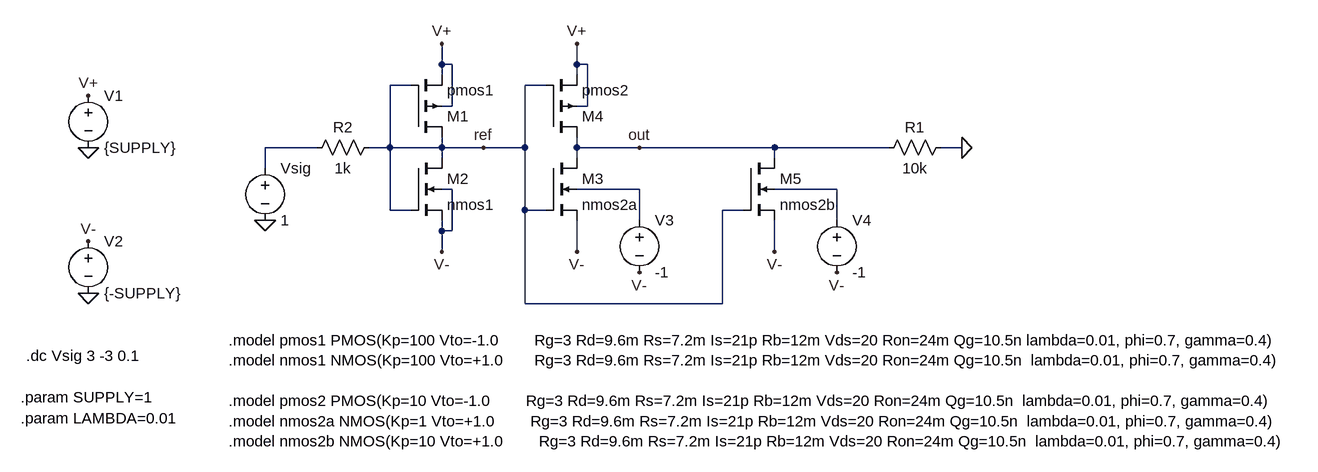
[diagram p0: schematic Week14_CMOS_Body_Effect.asc]
Week14_CMOS_Body_Effect.asc, the LTspice schematic file:
Version 4
SHEET 1 2176 680
WIRE 304 -112 304 -144
WIRE 320 -112 304 -112
WIRE 512 -112 512 -144
WIRE 528 -112 512 -112
WIRE 304 -96 304 -112
WIRE 512 -96 512 -112
WIRE 256 -80 224 -80
WIRE 464 -80 432 -80
WIRE 320 -48 320 -112
WIRE 320 -48 304 -48
WIRE 528 -48 528 -112
WIRE 528 -48 512 -48
WIRE 112 16 32 16
WIRE 224 16 224 -80
WIRE 224 16 192 16
WIRE 304 16 304 0
WIRE 304 16 224 16
WIRE 368 16 304 16
WIRE 432 16 432 -80
WIRE 432 16 368 16
WIRE 512 16 512 0
WIRE 608 16 512 16
WIRE 816 16 608 16
WIRE 992 16 816 16
WIRE 1104 16 1072 16
WIRE 304 32 304 16
WIRE 512 32 512 16
WIRE 816 32 816 16
WIRE 32 48 32 16
WIRE 320 80 304 80
WIRE 608 80 512 80
WIRE 912 80 816 80
WIRE 224 112 224 16
WIRE 256 112 224 112
WIRE 432 112 432 16
WIRE 464 112 432 112
WIRE 768 112 736 112
WIRE 608 128 608 80
WIRE 912 128 912 80
WIRE 304 144 304 128
WIRE 320 144 320 80
WIRE 320 144 304 144
WIRE 304 176 304 144
WIRE 512 176 512 128
WIRE 816 176 816 128
WIRE 432 256 432 112
WIRE 736 256 736 112
WIRE 736 256 432 256
FLAG -240 16 0
FLAG -240 -64 V+
FLAG -240 240 0
FLAG -240 160 V-
FLAG 304 -144 V+
FLAG 32 128 0
FLAG 304 176 V-
FLAG 512 -144 V+
FLAG 512 176 V-
FLAG 608 16 out
FLAG 368 16 ref
FLAG 1104 16 0
FLAG 816 176 V-
FLAG 608 208 V-
FLAG 912 208 V-
SYMBOL voltage -240 -80 R0
WINDOW 123 0 0 Left 0
WINDOW 39 0 0 Left 0
SYMATTR InstName V1
SYMATTR Value {SUPPLY}
SYMBOL voltage -240 144 R0
WINDOW 123 0 0 Left 0
WINDOW 39 0 0 Left 0
SYMATTR InstName V2
SYMATTR Value {-SUPPLY}
SYMBOL voltage 32 32 R0
WINDOW 123 0 0 Left 0
WINDOW 39 0 0 Left 0
SYMATTR InstName Vsig
SYMATTR Value 1
SYMBOL res 96 32 R270
WINDOW 0 32 56 VTop 2
WINDOW 3 0 56 VBottom 2
SYMATTR InstName R2
SYMATTR Value 1k
SYMBOL res 976 32 R270
WINDOW 0 32 56 VTop 2
WINDOW 3 0 56 VBottom 2
SYMATTR InstName R1
SYMATTR Value 10k
SYMBOL pmos4 256 0 M180
SYMATTR InstName M1
SYMATTR Value pmos1
SYMBOL pmos4 464 0 M180
SYMATTR InstName M4
SYMATTR Value pmos2
SYMBOL nmos4 256 32 R0
SYMATTR InstName M2
SYMATTR Value nmos1
SYMBOL nmos4 464 32 R0
SYMATTR InstName M3
SYMATTR Value nmos2a
SYMBOL nmos4 768 32 R0
SYMATTR InstName M5
SYMATTR Value nmos2b
SYMBOL voltage 608 112 R0
WINDOW 123 0 0 Left 0
WINDOW 39 0 0 Left 0
SYMATTR InstName V3
SYMATTR Value -1
SYMBOL voltage 912 112 R0
WINDOW 123 0 0 Left 0
WINDOW 39 0 0 Left 0
SYMATTR InstName V4
SYMATTR Value -1
TEXT -24 312 Left 2 !.model pmos1 PMOS(Kp=100 Vto=-1.0        Rg=3 Rd=9.6m Rs=7.2m Is=21p Rb=12m Vds=20 Ron=24m Qg=10.5n lambda=0.01, phi=0.7, gamma=0.4)\n.model nmos1 NMOS(Kp=100 Vto=+1.0       Rg=3 Rd=9.6m Rs=7.2m Is=21p Rb=12m Vds=20 Ron=24m Qg=10.5n  lambda=0.01, phi=0.7, gamma=0.4)\n \n.model pmos2 PMOS(Kp=10 Vto=-1.0        Rg=3 Rd=9.6m Rs=7.2m Is=21p Rb=12m Vds=20 Ron=24m Qg=10.5n  lambda=0.01, phi=0.7, gamma=0.4)\n.model nmos2a NMOS(Kp=1 Vto=+1.0        Rg=3 Rd=9.6m Rs=7.2m Is=21p Rb=12m Vds=20 Ron=24m Qg=10.5n  lambda=0.01, phi=0.7, gamma=0.4)\n.model nmos2b NMOS(Kp=10 Vto=+1.0        Rg=3 Rd=9.6m Rs=7.2m Is=21p Rb=12m Vds=20 Ron=24m Qg=10.5n  lambda=0.01, phi=0.7, gamma=0.4)
TEXT -344 400 Left 2 !.param SUPPLY=1
TEXT -336 336 Left 2 !.dc Vsig 3 -3 0.1
TEXT -344 432 Left 2 !.param LAMBDA=0.01

The netlist it stands for:
* Week14_CMOS_Body_Effect.asc
V1 V+ 0 {SUPPLY}
V2 V- 0 {-SUPPLY}
Vsig N001 0 1
R2 N001 ref 1k
R1 out 0 10k
M1 ref ref V+ V+ pmos1
M4 out ref V+ V+ pmos2
M2 ref ref V- V- nmos1
M3 out ref V- N002 nmos2a
M5 out ref V- N003 nmos2b
V3 N002 V- -1
V4 N003 V- -1
.model NMOS NMOS
.model PMOS PMOS
.lib standard.mos
.model pmos1 PMOS(Kp=100 Vto=-1.0        Rg=3 Rd=9.6m Rs=7.2m Is=21p Rb=12m Vds=20 Ron=24m Qg=10.5n lambda=0.01, phi=0.7, gamma=0.4)
.model nmos1 NMOS(Kp=100 Vto=+1.0       Rg=3 Rd=9.6m Rs=7.2m Is=21p Rb=12m Vds=20 Ron=24m Qg=10.5n  lambda=0.01, phi=0.7, gamma=0.4)
.model pmos2 PMOS(Kp=10 Vto=-1.0        Rg=3 Rd=9.6m Rs=7.2m Is=21p Rb=12m Vds=20 Ron=24m Qg=10.5n  lambda=0.01, phi=0.7, gamma=0.4)
.model nmos2a NMOS(Kp=1 Vto=+1.0        Rg=3 Rd=9.6m Rs=7.2m Is=21p Rb=12m Vds=20 Ron=24m Qg=10.5n  lambda=0.01, phi=0.7, gamma=0.4)
.model nmos2b NMOS(Kp=10 Vto=+1.0        Rg=3 Rd=9.6m Rs=7.2m Is=21p Rb=12m Vds=20 Ron=24m Qg=10.5n  lambda=0.01, phi=0.7, gamma=0.4)
.param SUPPLY=1
.dc Vsig 3 -3 0.1
.param LAMBDA=0.01
.backanno
.end